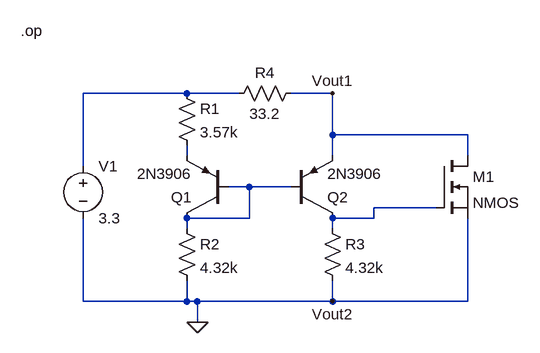
[diagram p0: schematic bias_network.asc]
bias_network.asc, the LTspice schematic file:
Version 4
SHEET 1 880 680
WIRE 368 160 208 160
WIRE 448 160 368 160
WIRE 592 160 528 160
WIRE 592 224 592 160
WIRE 800 224 592 224
WIRE 368 256 368 240
WIRE 592 256 592 224
WIRE 800 256 800 224
WIRE 208 272 208 160
WIRE 464 304 432 304
WIRE 528 304 464 304
WIRE 752 336 656 336
WIRE 464 352 464 304
WIRE 464 352 368 352
WIRE 656 352 656 336
WIRE 656 352 592 352
WIRE 368 368 368 352
WIRE 592 368 592 352
WIRE 208 480 208 352
WIRE 368 480 368 448
WIRE 368 480 208 480
WIRE 384 480 368 480
WIRE 592 480 592 448
WIRE 592 480 384 480
WIRE 800 480 800 352
WIRE 800 480 592 480
WIRE 384 512 384 480
FLAG 592 160 Vout1
FLAG 592 480 Vout2
FLAG 384 512 0
SYMBOL voltage 208 256 R0
SYMATTR InstName V1
SYMATTR Value 3.3
SYMBOL res 352 144 R0
SYMATTR InstName R1
SYMATTR Value 3.57k
SYMBOL res 352 352 R0
SYMATTR InstName R2
SYMATTR Value 4.32k
SYMBOL res 576 352 R0
SYMATTR InstName R3
SYMATTR Value 4.32k
SYMBOL res 544 144 R90
WINDOW 0 0 56 VBottom 2
WINDOW 3 32 56 VTop 2
SYMATTR InstName R4
SYMATTR Value 33.2
SYMBOL pnp 432 352 R180
SYMATTR InstName Q1
SYMATTR Value 2N3906
SYMBOL pnp 528 352 M180
SYMATTR InstName Q2
SYMATTR Value 2N3906
SYMBOL nmos 752 256 R0
SYMATTR InstName M1
TEXT 112 64 Left 2 !.op

The netlist it stands for:
* bias_network.asc
V1 N001 0 3.3
R1 N001 N002 3.57k
R2 N003 0 4.32k
R3 N004 0 4.32k
R4 Vout1 N001 33.2
Q1 N003 N003 N002 0 2N3906
Q2 N004 N003 Vout1 0 2N3906
M1 Vout1 N004 0 0 NMOS
.model NPN NPN
.model PNP PNP
.lib standard.bjt
.model NMOS NMOS
.model PMOS PMOS
.lib standard.mos
.op
.backanno
.end